# EAGLE design tsop (EAGLE 8.2.1)
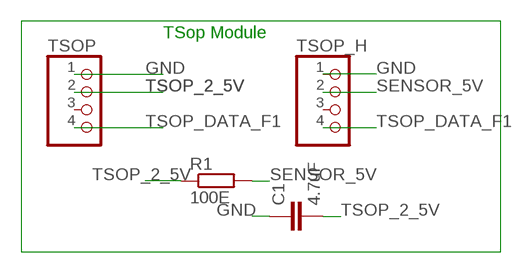
[diagram p0: schematic, sheet 1]

## Parts
C1  4.7uF  C-EUC1206  [C1206]
R1  100E  R-EU_R1206  [R1206]
TSOP  PINHD-1X4  [1X04]
TSOP_H  PINHD-1X4  [1X04]

## Nets
GND: C1.1 TSOP.1 TSOP_H.1
SENSOR_5V: R1.2 TSOP_H.2
TSOP_2_5V: C1.2 R1.1 TSOP.2
TSOP_DATA_F1: TSOP.4 TSOP_H.4
Unconnected: TSOP.3 TSOP_H.3

## Notes on the sheet
- TSop Module

## Library data of the parts
C1 = rcl:C-EU: CAPACITOR, European symbol
R1 = rcl:R-EU_: RESISTOR, European symbol
TSOP TSOP_H = pinhead:PINHD-1X4: PIN HEADER

## Board
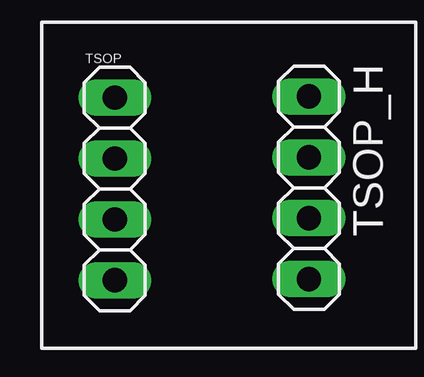
[diagram p1: board, top side]
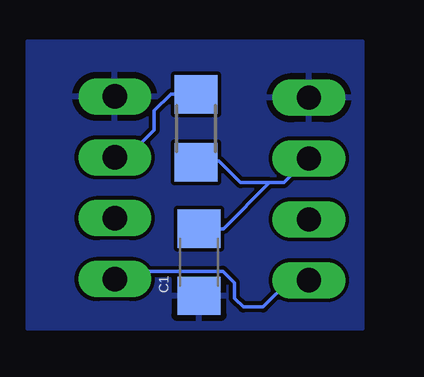
[diagram p2: board, bottom side, seen from below]

No outline drawn. Coordinates in mm, seen from the top.
Copper layers (1*16): Top 0.035mm / dielectric 1.5mm / Bottom 0.035mm
Design rules "default": minimum track width 6mil, minimum drill 0.35mm, track to track 6mil, track to pad 6mil, pad to pad 6mil, via to via 6mil, smd to smd 6mil, copper to edge 40mil, drill to drill 6mil, minimum pad ring 10mil, minimum via ring 8mil, stop-mask expansion 4mil, vias tented up to drill 0mil, thermal gap 10mil

### Footprints (pad centres in the part's own frame; a part is rotated, then mirrored left to right if it is on the bottom)
C1206 = smd 1.6 x 1.8: 1 -1.4,0; 2 1.4,0
R1206 = smd 1.6 x 1.803: 1 -1.422,0; 2 1.422,0
1X04 = drill 1.016 long: 1 -3.81,0; 2 -1.27,0; 3 1.27,0; 4 3.81,0

### Placement (x,y rotation side)
C1  6.83,2.78 90 bottom
R1  6.96,8.37 90 bottom
TSOP  2.25,5.84 270 top
TSOP_H  10.35,5.89 270 top

### Tracks (layer width: path | path; a pad name or v marks a point on that pad's centre or on a via)
GND
  pour Bottom: 0,12 14,12 14,0 0,0
SENSOR_5V
  Bottom 0.152: R1.2 7,9.8 8,9.8 8.7,9.1 8.7,8.3 9.8,7.2 10.3,7.2 TSOP_H.2
TSOP_2_5V
  Bottom 0.152: 3.9,6.1 3.3,6.1 2.3,7.1 TSOP.2 | 3.9,6.1 5.1,6.1 6,7 6.9,7 R1.1 | C1.2 5.82,4.18 3.9,6.1
TSOP_DATA_F1
  Bottom 0.152: TSOP.4 3.04,2.03 4.16,0.91 4.99,0.91 5.36,1.28 5.36,1.93 5.83,2.41 9.5,2.41 9.83,2.08 TSOP_H.4